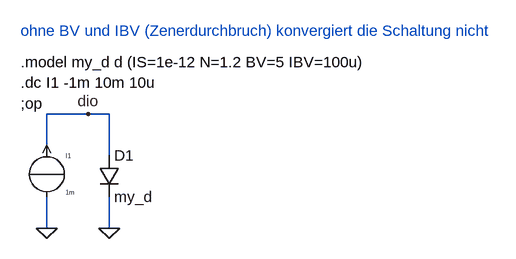
[diagram p0: schematic diode_problem.asc]
diode_problem.asc, the LTspice schematic file:
Version 4
SHEET 1 924 680
WIRE 208 64 144 64
WIRE 240 64 208 64
WIRE 144 112 144 64
WIRE 240 128 240 64
WIRE 144 240 144 192
WIRE 240 240 240 192
FLAG 144 240 0
FLAG 240 240 0
FLAG 208 64 dio
SYMBOL diode 224 128 R0
SYMATTR InstName D1
SYMATTR Value my_d
SYMBOL source-I 144 112 R0
SYMATTR InstName I1
SYMATTR Value 1m
TEXT 104 48 Left 2 !;op
TEXT 104 16 Left 2 !.dc I1 -1m 10m 10u
TEXT 104 -16 Left 2 !.model my_d d (IS=1e-12 N=1.2 BV=5 IBV=100u)
TEXT 104 -64 Left 2 ;ohne BV und IBV (Zenerdurchbruch) konvergiert die Schaltung nicht

The netlist it stands for:
* diode_problem.asc
D1 dio 0 my_d
I1 0 dio 1m
.model D D
.lib standard.dio
;op
.dc I1 -1m 10m 10u
.model my_d d (IS=1e-12 N=1.2 BV=5 IBV=100u)
* ohne BV und IBV (Zenerdurchbruch) konvergiert die Schaltung nicht
.backanno
.end